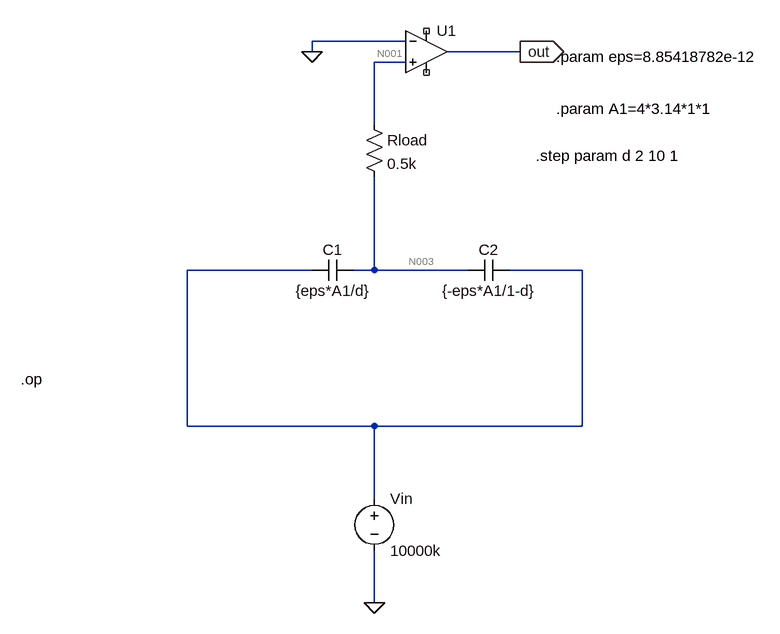
[diagram p0: schematic Cap_Sensor_Sim.asc]
Cap_Sensor_Sim.asc, the LTspice schematic file:
Version 4.1
SHEET 1 1164 680
WIRE 272 -320 128 -320
WIRE 128 -304 128 -320
WIRE 448 -304 336 -304
WIRE 272 -288 224 -288
WIRE 224 -192 224 -288
WIRE 128 32 -64 32
WIRE 224 32 224 -112
WIRE 224 32 192 32
WIRE 368 32 224 32
WIRE 544 32 432 32
WIRE -64 272 -64 32
WIRE 224 272 -64 272
WIRE 544 272 544 32
WIRE 544 272 224 272
WIRE 224 384 224 272
WIRE 224 544 224 464
FLAG 128 -304 0
FLAG 448 -304 out
IOPIN 448 -304 Out
FLAG 224 544 0
SYMBOL cap 432 16 R90
WINDOW 0 0 32 VBottom 2
WINDOW 3 32 32 VTop 2
SYMATTR InstName C2
SYMATTR Value {-eps*A1/1-d}
SYMBOL cap 192 16 R90
WINDOW 0 0 32 VBottom 2
WINDOW 3 32 32 VTop 2
SYMATTR InstName C1
SYMATTR Value {eps*A1/d}
SYMBOL res 208 -208 R0
SYMATTR InstName Rload
SYMATTR Value 0.5k
SYMBOL OpAmps\\UniversalOpAmp2 304 -304 R0
SYMATTR InstName U1
SYMBOL voltage 224 368 R0
WINDOW 123 0 0 Left 0
WINDOW 39 0 0 Left 0
SYMATTR InstName Vin
SYMATTR Value 10000k
TEXT 504 -296 Left 2 !.param eps=8.85418782e-12
TEXT 504 -216 Left 2 !.param A1=4*3.14*1*1
TEXT -320 200 Left 2 !.op
TEXT 472 -144 Left 2 !.step param d 2 10 1

The netlist it stands for:
* Cap_Sensor_Sim.asc
C2 N002 N003 {-eps*A1/1-d}
C1 N003 N002 {eps*A1/d}
Rload N001 N003 0.5k
X§U1 N001 0 NC_01 NC_02 out level2 Avol=1Meg GBW=10Meg Slew=10Meg Ilimit=25m Rail=0 Vos=0 En=0 Enk=0 In=0 Ink=0 Rin=500Meg  ; pins In+ In- V+ V- OUT
Vin N002 0 10000k
.param eps=8.85418782e-12
.param A1=4*3.14*1*1
.op
.step param d 2 10 1
.lib UniversalOpAmp2.lib
.backanno
.end

* Results of the author's LTspice run, read from the files saved beside the schematic
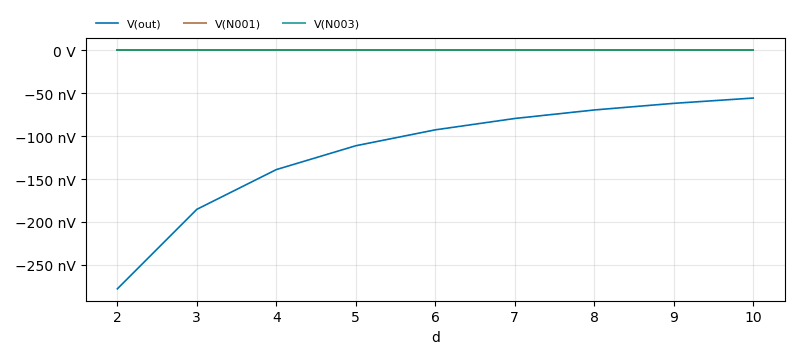
[diagram p1: Operating Point of Cap_Sensor_Sim.asc, plotted from the saved traces]
* Operating Point, 1 run:
*   V(out): -278 nV at d=2 , -55.6 nV at d=10 , min -278 nV, max -55.6 nV
*   V(N001): -111.3 fV at d=2 , -22.25 fV at d=10 , min -111.3 fV, max -22.25 fV
*   V(N003): 166.8 fV at d=2 , 33.35 fV at d=10 , min 33.35 fV, max 166.8 fV